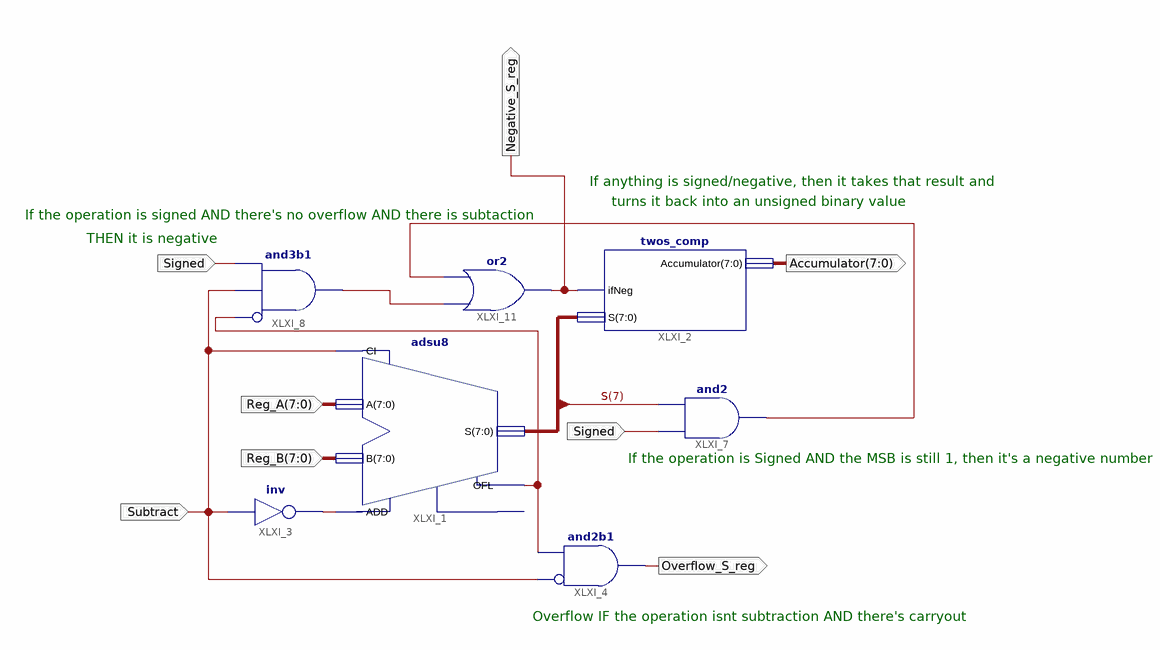
[diagram p0: schematic sheet 1]
// Xilinx ISE schematic ALU.sch (spartan3e) as structural Verilog: 7 symbols, 7 ports
module ALU (
  input  [7:0] Reg_A,
  input  [7:0] Reg_B,
  input  Subtract,
  input  Signed,
  output [7:0] Accumulator,
  output Overflow_S_reg,
  output Negative_S_reg
);

  wire XLXN_5, XLXN_20, XLXN_51, XLXN_52;
  wire [7:0] S;

  adsu8 XLXI_1 (.A(Reg_A), .ADD(XLXN_5), .B(Reg_B), .CI(Subtract), .OFL(XLXN_20), .S(S));  // open: CO
  twos_comp XLXI_2 (.S(S), .ifNeg(Negative_S_reg), .Accumulator(Accumulator));
  not XLXI_3 (XLXN_5, Subtract);
  and XLXI_4 (Overflow_S_reg, ~Subtract, XLXN_20);  // and2b1
  and XLXI_7 (XLXN_51, Signed, S[7]);
  and XLXI_8 (XLXN_52, ~XLXN_20, Subtract, Signed);  // and3b1
  or XLXI_11 (Negative_S_reg, XLXN_52, XLXN_51);

  // Notes on the sheet:
  //   If anything is signed/negative, then it takes that result and
  //   turns it back into an unsigned binary value
  //   If the operation is signed AND there's no overflow AND there is subtaction
  //   THEN it is negative
  //   If the operation is Signed AND the MSB is still 1, then it's a negative number
  //   Overflow IF the operation isnt subtraction AND there's carryout
endmodule
